# EAGLE schematic InteractivePlayPanel (EAGLE 6.3)
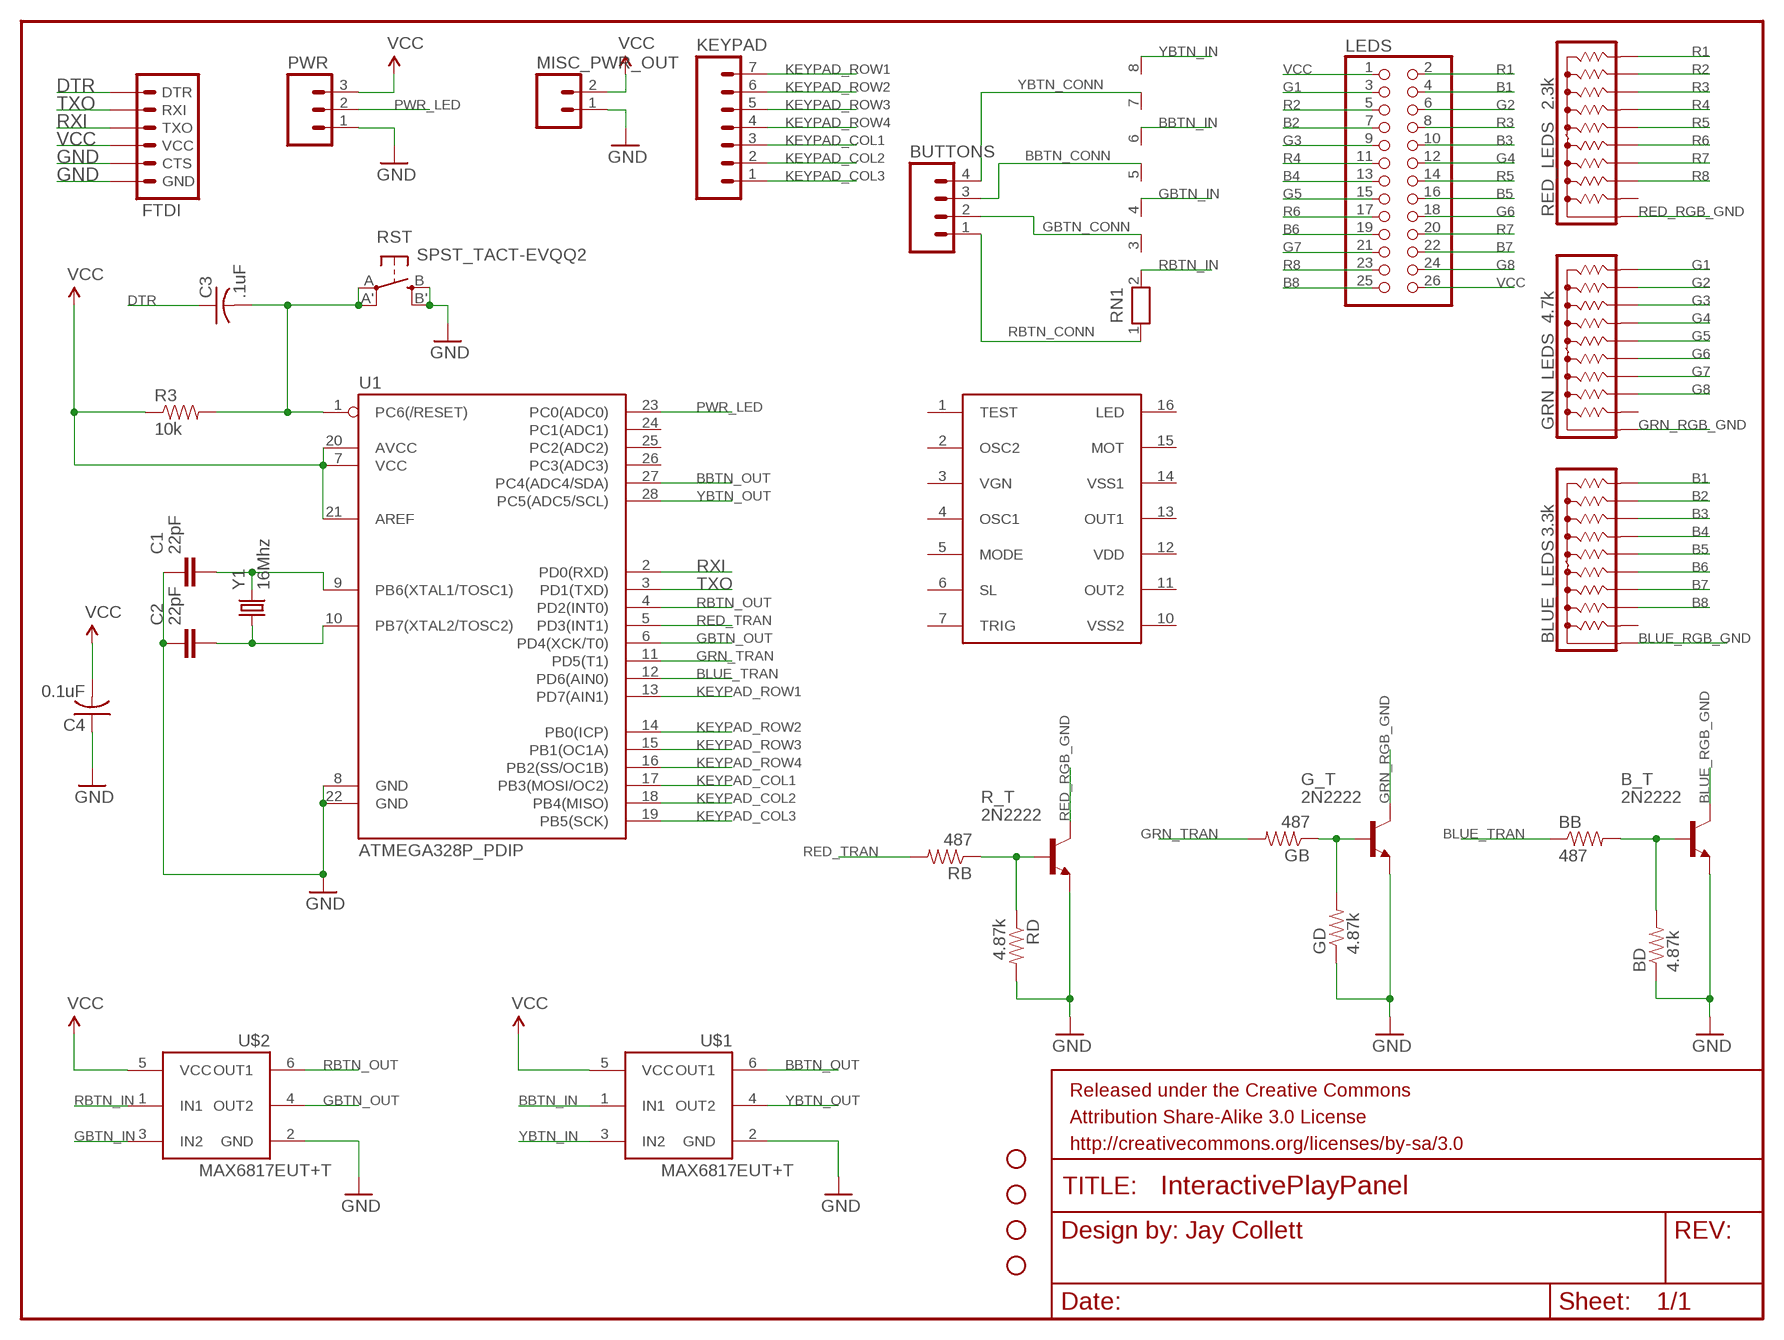
[diagram p0: schematic, sheet 1]

## Parts
B_T  2N2222  [TO92-EBC-OVAL]
BB  487  RESISTOREZ  [AXIAL-0.3EZ]
BD  4.87k  RESISTOREZ  [AXIAL-0.3EZ]
BLUE_LEDS  3.3k  4610X  [SIP10]
BUTTONS  M04LOCK_LONGPADS  [1X04_LOCK_LONGPADS]
C1  22pF  CAPACITOR_NPOL-0805  [C805]
C2  22pF  CAPACITOR_NPOL-0805  [C805]
C3  .1uF  C-USC0805  [C0805]
C4  0.1uF  C-USC0805  [C0805]
FRAME1  FRAME-LETTER  [CREATIVE_COMMONS]
FTDI  ARDUINO_SERIAL_PROGRAMLOCK  [1X06_LOCK]
G_T  2N2222  [TO92-EBC-OVAL]
GB  487  RESISTOREZ  [AXIAL-0.3EZ]
GD  4.87k  RESISTOREZ  [AXIAL-0.3EZ]
GRN_LEDS  4.7k  4610X  [SIP10]
KEYPAD  M07LOCK_LONGPADS  [1X07_LOCK_LONGPADS]
LEDS  PINHD-2X13  [2X13]
MISC_PWR_OUT  M02PTH3  [1X02_LONGPADS]
PWR  M03LOCK_LONGPADS  [1X03_LOCK_LONGPADS]
R3  10k  RESISTOR0805-RES  [0805]
R_T  2N2222  [TO92-EBC-OVAL]
RB  487  RESISTOREZ  [AXIAL-0.3EZ]
RD  4.87k  RESISTOREZ  [AXIAL-0.3EZ]
RED_LEDS  2.3k  4610X  [SIP10]
RN1  RN07  [RN-8]
RST  SPST_TACT-EVQQ2  [EVQ-Q2]
STANDOFF1  STAND-OFF  [STAND-OFF]
STANDOFF2  STAND-OFF  [STAND-OFF]
STANDOFF3  STAND-OFF  [STAND-OFF]
STANDOFF4  STAND-OFF  [STAND-OFF]
U1  ATMEGA328P_PDIP  [DIL28-3]
U$1  MAX6817EUT+T  [SOT-23-6]
U$2  MAX6817EUT+T  [SOT-23-6]
U$3  HK326-X  [DIL16]
Y1  16Mhz  CRYSTAL5X3  [CRYSTAL-SMD-5X3]

## Nets
B1: BLUE_LEDS.10 LEDS.4
B2: BLUE_LEDS.9 LEDS.7
B3: BLUE_LEDS.8 LEDS.10
B4: BLUE_LEDS.7 LEDS.13
B5: BLUE_LEDS.6 LEDS.16
B6: BLUE_LEDS.5 LEDS.19
B7: BLUE_LEDS.4 LEDS.22
B8: BLUE_LEDS.3 LEDS.25
BBTN_CONN: BUTTONS.3 RN1.5
BBTN_IN: RN1.6 U$1.1(IN1)
BBTN_OUT: U1.27(PC4(ADC4/SDA)) U$1.6(OUT1)
BLUE_RGB_GND: B_T.C BLUE_LEDS.1
BLUE_TRAN: BB.P$1 U1.12(PD6(AIN0))
DTR: C3.1 FTDI.1(DTR)
G1: GRN_LEDS.10 LEDS.3
G2: GRN_LEDS.9 LEDS.6
G3: GRN_LEDS.8 LEDS.9
G4: GRN_LEDS.7 LEDS.12
G5: GRN_LEDS.6 LEDS.15
G6: GRN_LEDS.5 LEDS.18
G7: GRN_LEDS.4 LEDS.21
G8: GRN_LEDS.3 LEDS.24
GBTN_CONN: BUTTONS.2 RN1.3
GBTN_IN: RN1.4 U$2.3(IN2)
GBTN_OUT: U1.6(PD4(XCK/T0)) U$2.4(OUT2)
GND: B_T.E BD.P$1 C1.1 C2.1 C4.1 FTDI.5(CTS) FTDI.6(GND) G_T.E GD.P$1 MISC_PWR_OUT.1 PWR.1 R_T.E RD.P$2 RST.B'(S1) RST.B(S) U1.8(GND) U1.22(GND) U$1.2(GND) U$2.2(GND)
GRN_RGB_GND: G_T.C GRN_LEDS.1
GRN_TRAN: GB.P$2 U1.11(PD5(T1))
KEYPAD_COL1: KEYPAD.3 U1.17(PB3(MOSI/OC2))
KEYPAD_COL2: KEYPAD.2 U1.18(PB4(MISO))
KEYPAD_COL3: KEYPAD.1 U1.19(PB5(SCK))
KEYPAD_ROW1: KEYPAD.7 U1.13(PD7(AIN1))
KEYPAD_ROW2: KEYPAD.6 U1.14(PB0(ICP))
KEYPAD_ROW3: KEYPAD.5 U1.15(PB1(OC1A))
KEYPAD_ROW4: KEYPAD.4 U1.16(PB2(SS/OC1B))
N$2: C1.2 U1.9(PB6(XTAL1/TOSC1)) Y1.3
N$3: C2.2 U1.10(PB7(XTAL2/TOSC2)) Y1.1
N$4: R_T.B RB.P$1 RD.P$1
N$5: G_T.B GB.P$1 GD.P$2
N$6: B_T.B BB.P$2 BD.P$2
PWR_LED: PWR.2 U1.23(PC0(ADC0))
R1: LEDS.2 RED_LEDS.10
R2: LEDS.5 RED_LEDS.9
R3: LEDS.8 RED_LEDS.8
R4: LEDS.11 RED_LEDS.7
R5: LEDS.14 RED_LEDS.6
R6: LEDS.17 RED_LEDS.5
R7: LEDS.20 RED_LEDS.4
R8: LEDS.23 RED_LEDS.3
RBTN_CONN: BUTTONS.1 RN1.1
RBTN_IN: RN1.2 U$2.1(IN1)
RBTN_OUT: U1.4(PD2(INT0)) U$2.6(OUT1)
RED_RGB_GND: R_T.C RED_LEDS.1
RED_TRAN: RB.P$2 U1.5(PD3(INT1))
RST: C3.2 R3.2 RST.A'(P1) RST.A(P) U1.1(PC6(/RESET))
RXI: FTDI.3(TXO) U1.2(PD0(RXD))
TXO: FTDI.2(RXI) U1.3(PD1(TXD))
VCC: C4.2 FTDI.4(VCC) LEDS.1 LEDS.26 MISC_PWR_OUT.2 PWR.3 R3.1 U1.7(VCC) U1.20(AVCC) U1.21(AREF) U$1.5(VCC) U$2.5(VCC)
YBTN_CONN: BUTTONS.4 RN1.7
YBTN_IN: RN1.8 U$1.3(IN2)
YBTN_OUT: U1.28(PC5(ADC5/SCL)) U$1.4(OUT2)
Unconnected: BLUE_LEDS.2 GRN_LEDS.2 RED_LEDS.2 U1.24(PC1(ADC1)) U1.25(PC2(ADC2)) U1.26(PC3(ADC3)) U$3.1(TEST) U$3.2(OSC2) U$3.3(VGN) U$3.4(OSC1) U$3.5(MODE) U$3.6(SL) U$3.7(TRIG) U$3.10(VSS2) U$3.11(OUT2) U$3.12(VDD) U$3.13(OUT1) U$3.14(VSS1) U$3.15(MOT) U$3.16(LED)

## Notes on the sheet
- Jay Collett

## Library data of the parts
B_T G_T R_T = adafruit:2N2222: NPN TRANSISTOR Big oval pads
BB BD GB GD R3 RB RD = SparkFun-Passives:RESISTOR: Resistor Basic schematic elements and footprints for 0603, 1206, and PTH resistors.
BLUE_LEDS GRN_LEDS RED_LEDS = resistor-sip:4610X: Bourns 4600X Series - Thick Film Conformal SIPs 4610X-101 Resistor Network Configuration: 101 (Bussed Resistors) Resistance range: 10 ohms to 10 Megaohms Maximum Operating Voltage: 100V Source: http://www.bourns.com/ProductLine.aspx?name=standard_thick_film_networks PDF: http://www.bourns.com/data/global/pdfs/4600X.pdf
BUTTONS = SparkFun-Connectors:M04: Header 4 Standard 4-pin 0.1" header. Use with straight break away headers (SKU : PRT-00116), right angle break away headers (PRT-00553), swiss pins (PRT-00743), machine pins (PRT-00117), and female headers (PRT-00115). Molex polarized connector foot print use with SKU : PRT-08231 with associated crimp pins and housings. 1MM SMD Version SKU: PRT-10208
C1 C2 = dp_devices:CAPACITOR_NPOL: Non-Polarized capacitor in various packages
C3 C4 = adafruit:C-US: CAPACITOR, American symbol
FRAME1 = SparkFun-Aesthetics:FRAME-LETTER: Schematic Frame Standard 8.5x11 US Letter frame
FTDI = SparkFun-Connectors:ARDUINO_SERIAL_PROGRAM: FTDI connector footprints
KEYPAD = SparkFun-Connectors:M07: Header 7 Standard 7-pin 0.1" header. Use with straight break away headers (SKU : PRT-00116), right angle break away headers (PRT-00553), swiss pins (PRT-00743), machine pins (PRT-00117), and female headers (PRT-00115). NOTES ON THE VARIANTS LOCK and LOCK_LONGPADS... This footprint was designed to help hold the alignment of a through-hole component (i.e. 7-pin header) while soldering it into place. You may notice that each hole has been shifted either up or down by 0.005 of an inch from it's more standard position (which is usually a perfectly straight line). This slight alteration caused the pins (the squares in the middle) to touch the edges of the holes. Because they are alternating, it causes a "brace" to hold the header in place. 0.005 has proven to be the perfect amount of "off-center" position when using our standard breakaway headers. Although looks a little odd when you look at the bare footprint, once you have a header in there, the alteration is very hard to notice. Also, if you push a header all the way into place, it is covered up entirely on the bottom side. This idea of altering the position of holes to aid alignment will be further integrated into the Sparkfun Library for other footprints. It can help hold any component with 3 or more connection pins.
LEDS = pinhead:PINHD-2X13: PIN HEADER
MISC_PWR_OUT = SparkFun-Connectors:M02: Header 2 Standard 2-pin 0.1" header. Use with straight break away headers (SKU : PRT-00116), right angle break away headers (PRT-00553), swiss pins (PRT-00743), machine pins (PRT-00117), and female headers (PRT-00115). Molex polarized connector foot print use with SKU : PRT-08233 with associated crimp pins and housings.
PWR = SparkFun-Connectors:M03: Header 3 Standard 3-pin 0.1" header. Use with straight break away headers (SKU : PRT-00116), right angle break away headers (PRT-00553), swiss pins (PRT-00743), machine pins (PRT-00117), and female headers (PRT-00115). Molex polarized connector foot print use with SKU : PRT-08232 with associated crimp pins and housings.
RN1 = resistor-net:RN07: RESISTOR NETWORK; OC_FARNELL: unknown; OC_NEWARK: unknown
RST = adafruit:SPST_TACT: SMT 6mm switch, EVQQ2 series http://www.ladyada.net/library/eagle
STANDOFF1-STANDOFF4 = SparkFun-Electromechanical:STAND-OFF: #4 Stand Off This is the mechanical footprint for a #4 phillips button head screw. Use the keepout ring to avoid running the screw head into surrounding components. SKU : PRT-00447
U1 = SparkFun-DigitalIC:ATMEGA328P_PDIP: uC used in the Arduino 32kb flash, 1k EEPROM, 2k SRAM This is the through-hole version of this chip.
U$1 U$2 = JayCollett:MAX6817EUT+T: Maxim MAX6817 SMD dual debounce chip. http://datasheets.maxim-ic.com/en/ds/MAX6816-MAX6818.pdf
U$3 = JayCollett:HK326-X
Y1 = SparkFun-FreqCtrl:CRYSTAL: Various standard crystals. Proven footprints. Spark Fun Electronics SKU : COM-00534